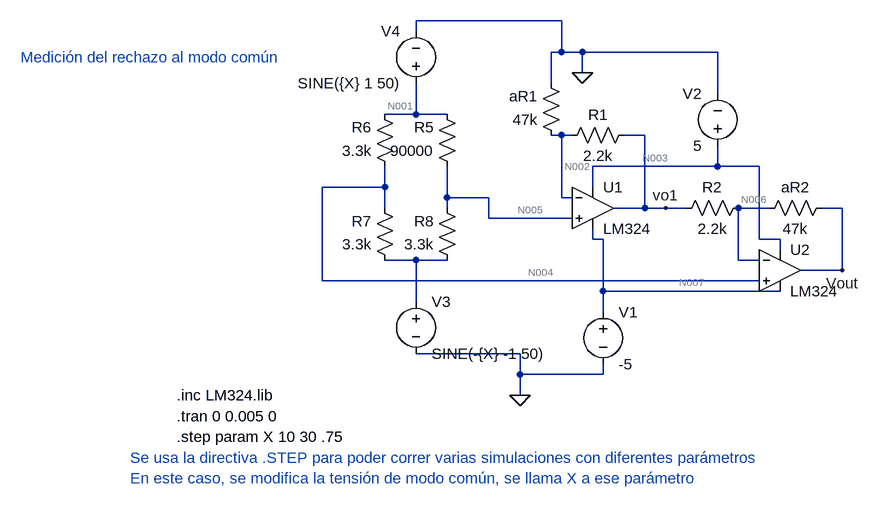
[diagram p0: schematic circuito2.4.asc]
circuito2.4.asc, the LTspice schematic file:
Version 4
SHEET 1 880 680
WIRE 144 -144 -80 -144
WIRE -80 -128 -80 -144
WIRE 144 -96 144 -144
WIRE 144 -96 128 -96
WIRE 176 -96 144 -96
WIRE 384 -96 176 -96
WIRE 176 -64 176 -96
WIRE 128 -48 128 -96
WIRE 384 -32 384 -96
WIRE -80 0 -80 -48
WIRE -80 0 -128 0
WIRE -32 0 -80 0
WIRE 144 32 128 32
WIRE 160 32 144 32
WIRE 272 32 240 32
WIRE 384 80 384 48
WIRE 384 80 192 80
WIRE 448 80 384 80
WIRE -128 112 -128 80
WIRE -128 112 -224 112
WIRE 192 112 192 80
WIRE -32 128 -32 80
WIRE 32 128 -32 128
WIRE 144 128 144 32
WIRE 160 128 144 128
WIRE -128 144 -128 112
WIRE -32 144 -32 128
WIRE 272 144 272 32
WIRE 272 144 224 144
WIRE 304 144 272 144
WIRE 336 144 304 144
WIRE 464 144 416 144
WIRE 576 144 544 144
WIRE 32 160 32 128
WIRE 160 160 32 160
WIRE 192 192 192 176
WIRE 208 192 192 192
WIRE 448 192 448 80
WIRE 480 192 448 192
WIRE 480 208 480 192
WIRE -80 224 -128 224
WIRE -32 224 -80 224
WIRE 416 224 416 144
WIRE 448 224 416 224
WIRE 576 240 576 144
WIRE 576 240 512 240
WIRE -224 256 -224 112
WIRE 448 256 -224 256
WIRE 208 272 208 192
WIRE 480 272 208 272
WIRE -80 288 -80 224
WIRE 208 304 208 272
WIRE 80 368 -80 368
WIRE 80 400 80 368
WIRE 208 400 208 384
WIRE 208 400 80 400
WIRE 80 432 80 400
FLAG 80 432 0
FLAG 176 -64 0
FLAG 576 240 Vout
FLAG 304 144 vo1
SYMBOL opamp2 192 80 R0
SYMATTR InstName U1
SYMATTR Value LM324
SYMBOL res 256 16 R90
WINDOW 0 0 56 VBottom 2
WINDOW 3 32 56 VTop 2
SYMATTR InstName R1
SYMATTR Value 2.2k
SYMBOL res 432 128 R90
WINDOW 0 0 56 VBottom 2
WINDOW 3 32 56 VTop 2
SYMATTR InstName R2
SYMATTR Value 2.2k
SYMBOL res 560 128 R90
WINDOW 0 0 56 VBottom 2
WINDOW 3 32 56 VTop 2
SYMATTR InstName aR2
SYMATTR Value 47k
SYMBOL res 144 48 R180
WINDOW 0 36 76 Left 2
WINDOW 3 36 40 Left 2
SYMATTR InstName aR1
SYMATTR Value 47k
SYMBOL res -16 96 R180
WINDOW 0 36 76 Left 2
WINDOW 3 36 40 Left 2
SYMATTR InstName R5
SYMATTR Value 90000
SYMBOL res -112 96 R180
WINDOW 0 36 76 Left 2
WINDOW 3 36 40 Left 2
SYMATTR InstName R6
SYMATTR Value 3.3k
SYMBOL res -112 240 R180
WINDOW 0 36 76 Left 2
WINDOW 3 36 40 Left 2
SYMATTR InstName R7
SYMATTR Value 3.3k
SYMBOL res -16 240 R180
WINDOW 0 36 76 Left 2
WINDOW 3 36 40 Left 2
SYMATTR InstName R8
SYMATTR Value 3.3k
SYMBOL voltage 208 288 R0
WINDOW 123 0 0 Left 0
WINDOW 39 0 0 Left 0
SYMATTR InstName V1
SYMATTR Value -5
SYMBOL voltage 384 64 R180
WINDOW 0 24 96 Left 2
WINDOW 3 24 16 Left 2
WINDOW 123 0 0 Left 0
WINDOW 39 0 0 Left 0
SYMATTR InstName V2
SYMATTR Value 5
SYMBOL OpAmps\\opamp2 480 176 R0
SYMATTR InstName U2
SYMATTR Value LM324
SYMBOL voltage -80 272 R0
WINDOW 123 0 0 Left 0
WINDOW 39 0 0 Left 0
SYMATTR InstName V3
SYMATTR Value SINE(-{X} -1 50)
SYMBOL voltage -80 -32 R180
WINDOW 0 24 96 Left 2
WINDOW 3 24 16 Left 2
WINDOW 123 0 0 Left 0
WINDOW 39 0 0 Left 0
SYMATTR InstName V4
SYMATTR Value SINE({X} 1 50)
TEXT -448 432 Left 2 !.inc LM324.lib
TEXT -448 464 Left 2 !.tran 0 0.005 0
TEXT -688 -88 Left 2 ;Medición del rechazo al modo común
TEXT -520 528 Left 2 ;Se usa la directiva .STEP para poder correr varias simulaciones con diferentes parámetros
TEXT -520 560 Left 2 ;En este caso, se modifica la tensión de modo común, se llama X a ese parámetro
TEXT -448 496 Left 2 !.step param X 10 30 .75

The netlist it stands for:
* circuito2.4.asc
XU1 N005 N002 N003 N007 vo1 LM324  ; pins In+ In- V+ V- OUT
R1 vo1 N002 2.2k
R2 N006 vo1 2.2k
R§aR2 Vout N006 47k
R§aR1 N002 0 47k
R5 N005 N001 90000
R6 N004 N001 3.3k
R7 N008 N004 3.3k
R8 N008 N005 3.3k
V1 N007 0 -5
V2 N003 0 5
XU2 N004 N006 N003 N007 Vout LM324  ; pins In+ In- V+ V- OUT
V3 N008 0 SINE(-{X} -1 50)
V4 N001 0 SINE({X} 1 50)
.inc LM324.lib
.tran 0 0.005 0
* Medición del rechazo al modo común
* Se usa la directiva .STEP para poder correr varias simulaciones con diferentes parámetros
* En este caso, se modifica la tensión de modo común, se llama X a ese parámetro
.step param X 10 30 .75
.backanno
.end

* Results of the author's LTspice run, read from the files saved beside the schematic
* Operating Point (first step), zero values left out:
*   x = 10 
*   V(vo1) = 370.2 mV
*   V(n007) = -5 V
*   V(n003) = 5 V
*   V(n002) = 353.7 mV
*   V(n005) = 353.8 mV
*   V(n006) = 510 mV
*   V(vout) = 3.495 V
*   V(n001) = 10 V
*   V(n004) = 5 V
*   I(R8) = -107.2 µA
*   I(R7) = -1.515 mA
*   I(R6) = -1.515 mA
*   I(R5) = -107.2 µA
*   I(Ar1) = 7.526 µA
*   I(Ar2) = 63.52 µA
*   I(R2) = 63.55 µA
*   I(R1) = 7.506 µA
*   I(V4) = -1.622 mA
*   I(V3) = 1.622 mA
*   I(V2) = -672 µA
*   I(V1) = 679.7 µA
*   Ix(u1:1) = -19.89 nA
*   Ix(u1:2) = -19.91 nA
*   Ix(u1:3) = 340 µA
*   Ix(u1:4) = -339.9 µA
*   Ix(u1:5) = 56.05 µA
*   Ix(u2:1) = 13.86 pA
*   Ix(u2:2) = -39.77 nA
*   Ix(u2:3) = 332.1 µA
*   Ix(u2:4) = -339.9 µA
*   Ix(u2:5) = -63.51 µA
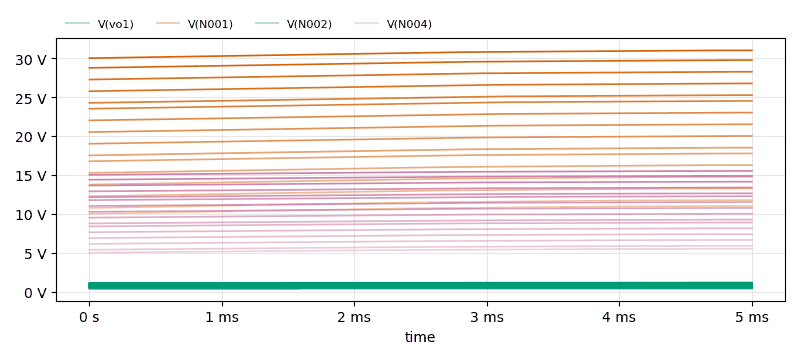
[diagram p1: Transient Analysis of circuito2.4.asc, plotted from the saved traces]
* Transient Analysis, 28 runs:
*   V(vo1) [run 1]: min 370.2 mV, max 407.2 mV, average 393.2 mV, rms 393.5 mV, last 407.2 mV
*   V(vo1) [run 2]: min 398 mV, max 435 mV, average 421 mV, rms 421.2 mV, last 435 mV
*   V(vo1) [run 3]: min 453.5 mV, max 490.5 mV, average 476.4 mV, rms 476.6 mV, last 490.5 mV
*   V(vo1) [run 4]: min 509.1 mV, max 546.1 mV, average 531.8 mV, rms 532 mV, last 546.1 mV
*   V(vo1) [run 5]: min 564.6 mV, max 601.6 mV, average 587.3 mV, rms 587.4 mV, last 601.6 mV
*   V(vo1) [run 6]: min 620.1 mV, max 657.1 mV, average 642.7 mV, rms 642.8 mV, last 657.1 mV
*   V(vo1) [run 7]: min 647.9 mV, max 684.9 mV, average 670.4 mV, rms 670.5 mV, last 684.9 mV
*   V(vo1) [run 8]: min 703.4 mV, max 740.4 mV, average 725.9 mV, rms 726 mV, last 740.4 mV
*   V(N001) [run 1]: min 10 V, max 11 V, average 10.62 V, rms 10.63 V, last 11 V
*   V(N001) [run 2]: min 10.75 V, max 11.75 V, average 11.37 V, rms 11.38 V, last 11.75 V
*   V(N001) [run 3]: min 12.25 V, max 13.25 V, average 12.87 V, rms 12.87 V, last 13.25 V
*   V(N001) [run 4]: min 13.75 V, max 14.75 V, average 14.37 V, rms 14.37 V, last 14.75 V
*   V(N001) [run 5]: min 15.25 V, max 16.25 V, average 15.86 V, rms 15.87 V, last 16.25 V
*   V(N001) [run 6]: min 16.75 V, max 17.75 V, average 17.36 V, rms 17.36 V, last 17.75 V
*   V(N001) [run 7]: min 17.5 V, max 18.5 V, average 18.11 V, rms 18.11 V, last 18.5 V
*   V(N001) [run 8]: min 19 V, max 20 V, average 19.61 V, rms 19.61 V, last 20 V
*   V(N002) [run 1]: min 353.7 mV, max 389.1 mV, average 375.7 mV, rms 375.9 mV, last 389.1 mV
*   V(N002) [run 2]: min 380.2 mV, max 415.6 mV, average 402.2 mV, rms 402.4 mV, last 415.6 mV
*   V(N002) [run 3]: min 433.3 mV, max 468.6 mV, average 455.1 mV, rms 455.3 mV, last 468.6 mV
*   V(N002) [run 4]: min 486.3 mV, max 521.7 mV, average 508.1 mV, rms 508.3 mV, last 521.7 mV
*   V(N002) [run 5]: min 539.4 mV, max 574.7 mV, average 561 mV, rms 561.2 mV, last 574.7 mV
*   V(N002) [run 6]: min 592.4 mV, max 627.8 mV, average 614 mV, rms 614.1 mV, last 627.8 mV
*   V(N002) [run 7]: min 619 mV, max 654.3 mV, average 640.4 mV, rms 640.6 mV, last 654.3 mV
*   V(N002) [run 8]: min 672 mV, max 707.4 mV, average 693.5 mV, rms 693.6 mV, last 707.4 mV
*   V(N004) [run 1]: min 5 V, max 5.5 V, average 5.311 V, rms 5.314 V, last 5.5 V
*   V(N004) [run 2]: min 5.375 V, max 5.875 V, average 5.685 V, rms 5.688 V, last 5.875 V
*   V(N004) [run 3]: min 6.125 V, max 6.625 V, average 6.434 V, rms 6.437 V, last 6.625 V
*   V(N004) [run 4]: min 6.875 V, max 7.375 V, average 7.183 V, rms 7.185 V, last 7.375 V
*   V(N004) [run 5]: min 7.625 V, max 8.125 V, average 7.931 V, rms 7.934 V, last 8.125 V
*   V(N004) [run 6]: min 8.375 V, max 8.875 V, average 8.68 V, rms 8.682 V, last 8.875 V
*   V(N004) [run 7]: min 8.75 V, max 9.25 V, average 9.054 V, rms 9.056 V, last 9.25 V
*   V(N004) [run 8]: min 9.5 V, max 10 V, average 9.803 V, rms 9.805 V, last 10 V